# Altium schematic sheet clock.SchDoc
size A4
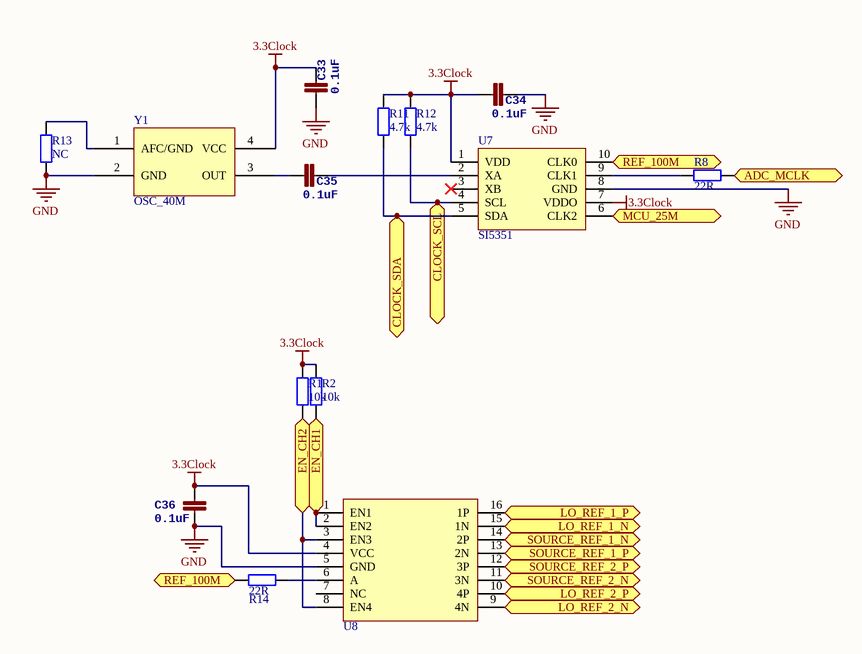
[diagram p0: clock.SchDoc]

## Parts
C33  0.1uF  [0402]
C34  0.1uF  [0402]
C35  0.1uF  [0402]
C36  0.1uF  [0402]
R1  10k  [0402]
R2  10k  [0402]
R8  22R  [0402]
R11  4.7k  [0402]
R12  4.7k  [0402]
R13  NC  [0402]
R14  22R  [0402]
U7  SI5351  [si5351]
U8  SN65LVDS105  [TSSOP16_44MM_065P - duplicate]  (value not drawn)
Y1  OSC_40M  [TXC_7Q]

## Ports
ADC_MCLK, CLOCK_SCL, CLOCK_SDA, EN_CH1, EN_CH2, LO_REF_1_N, LO_REF_1_P, LO_REF_2_N, LO_REF_2_P, MCU_25M, REF_100M, SOURCE_REF_1_N, SOURCE_REF_1_P, SOURCE_REF_2_N, SOURCE_REF_2_P

## Nets
3.3Clock: C33.2 C34.1 C36.2 R1.2 R2.2 R11.1 R12.1 U7.1(VDD) U7.7(VDDO) U8.4(VCC) Y1.4(VCC)
GND: C33.1 C34.2 C36.1 R13.2 U7.8(GND) U8.5(GND) Y1.2(GND)
ADC_MCLK: R8.2 ; port ADC_MCLK
CLOCK_SCL: R12.2 U7.4(SCL) ; port CLOCK_SCL
CLOCK_SDA: R11.2 U7.5(SDA) ; port CLOCK_SDA
EN_CH1: R2.1 U8.1(EN1) U8.2(EN2) ; port EN_CH1
EN_CH2: R1.1 U8.3(EN3) U8.8(EN4) ; port EN_CH2
LO_REF_1_N: U8.15(1N) ; port LO_REF_1_N
LO_REF_1_P: U8.16(1P) ; port LO_REF_1_P
LO_REF_2_N: U8.9(4N) ; port LO_REF_2_N
LO_REF_2_P: U8.10(4P) ; port LO_REF_2_P
MCU_25M: U7.6(CLK2) ; port MCU_25M
REF_100M: R14.2 U7.10(CLK0) ; port REF_100M
SOURCE_REF_1_N: U8.14(2P) ; port SOURCE_REF_1_N
SOURCE_REF_1_P: U8.13(2N) ; port SOURCE_REF_1_P
SOURCE_REF_2_N: U8.11(3N) ; port SOURCE_REF_2_N
SOURCE_REF_2_P: U8.12(3P) ; port SOURCE_REF_2_P
NetC35_1: C35.1 Y1.3(OUT)
NetC35_2: C35.2 U7.2(XA)
NetR8_1: R8.1 U7.9(CLK1)
NetR13_1: R13.1 Y1.1(AFC/GND)
NetR14_1: R14.1 U8.6(A)

Not connected (* = marked no-connect by the designer): U7 3(XB)*; U8 7(NC)

## Library data of the parts
C33-C36 = CAP0402-CAP: <b>Capacitor</b> / Standard 0603 ceramic capacitor, and 0.1" leaded capacitor.; PARTNO: CC0402ZRY5V7BB104
R1 R2 R8 R11-R14 = Res2: Resistor; Published: 8-Jun-2000; LatestRevisionDate: 17-Jul-2002; LatestRevisionNote: Re-released for DXP Platform.; PackageReference: AXIAL-0.4; Publisher: Altium Limited; PackageDescription: Axial Device, Thru-Hole; 2 Leads; 0.4 in Pin Spacing